# Altium schematic sheet Microcontroller.SchDoc: Micro
size 420 x 297 mm; Date: UNUSED; CompanyName: CMT; DrawnBy: UNUSED; Engineer: UNUSED; Organization: Curtin Motorsport Team; Address1: Rm 151 Building 206; Address2: Curtin University; Address3: Kent Street, Bentley; Address4: Western Australia; DocumentNumber: UNUSED; Revision: UNUSED; SheetNumber: 3; SheetTotal: 5; Year: UNUSED; SheetSize: A3; Time: UNUSED; ImagePath: UNUSED; Application_BuildNumber: UNUSED
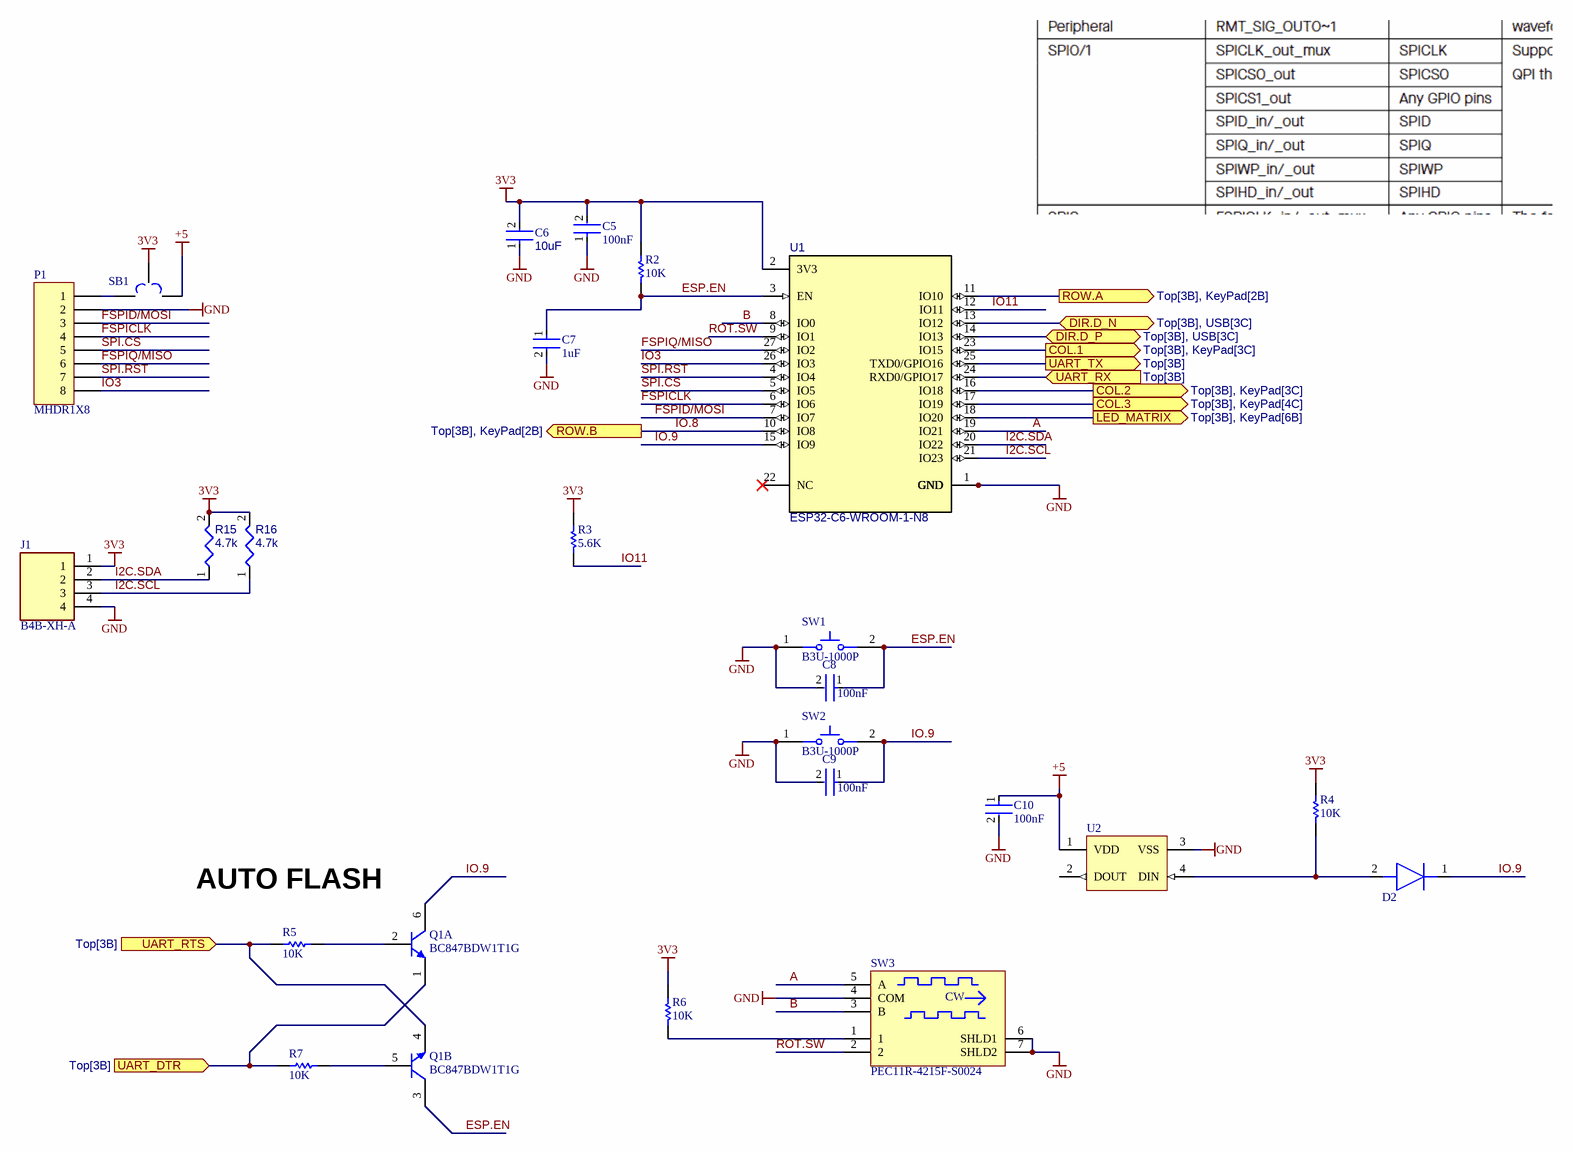
[diagram p0: Microcontroller.SchDoc]

## Parts
C5  100nF  [FP-GRM188-0_1-e0_2_0_55-IPC_A]
C6  Capacitance: 10uF  [FP-C1608-080-IPC_A]  (hidden comment: C1608X5R1E106M080AC)
C7  1uF  [FP-CC0603-DA-MFG]
C8  100nF  [FP-GRM188-0_1-e0_2_0_55-IPC_A]
C9  100nF  [FP-GRM188-0_1-e0_2_0_55-IPC_A]
C10  100nF  [FP-GRM188-0_1-e0_2_0_55-IPC_A]
D2  NSVR1020MW2T1G  [SOD2512X110N]  (value not drawn)
J1  B4B-XH-A  [B4BXHA]
P1  MHDR1X8  [MHDR1X8]
Q1  BC847BDW1T1G  [ONSC-SOT-363-6-419B-02_W_V]  (parts A,B of 2)
R2  10K  [RESC1609X50X30NL10T20]
R3  5.6K  [RESC1609X50X30NL10T20]
R4  10K  [RESC1609X50X30NL10T20]
R5  10K  [RESC1609X50X30NL10T20]
R6  10K  [RESC1609X50X30NL10T20]
R7  10K  [RESC1609X50X30NL10T20]
R15  value 4.7k  [RESC1608X55X25ML10T15]  (hidden comment: Resistor 4k7 +/-1% 0603 100 mW)
R16  value 4.7k  [RESC1608X55X25ML10T15]  (hidden comment: Resistor 4k7 +/-1% 0603 100 mW)
SB1  3 POS Solder Bridge  [3 POS Solder Bridge-Footprint-1]  (value not drawn)  (no BOM)
SW1  B3U-1000P  [OMRON-B3U-1000_V]
SW2  B3U-1000P  [OMRON-B3U-1000_V]
SW3  PEC11R-4215F-S0024  [BOUR-PEC11R-4XXXF-SXXXX_V]
U1  ESP32-C6-WROOM-1-N8  [ESP32-C6-WROOM-1-N8-Footprint-1]
U2  WS2812B  [ADAI-WS2812B_V]  (value not drawn)

## Ports
COL.1 (out, see Top[3B], KeyPad[3C]), COL.2 (out, see Top[3B], KeyPad[3C]), COL.3 (out, see Top[3B], KeyPad[4C]), DIR.D_N (bidir, see Top[3B], USB[3C]), DIR.D_P (bidir, see Top[3B], USB[3C]), LED_MATRIX (out, see Top[3B], KeyPad[6B]), ROW.A (out, see Top[3B], KeyPad[2B]), ROW.B (out, see Top[3B], KeyPad[2B]), UART_DTR (in, see Top[3B]), UART_RTS (in, see Top[3B]), UART_RX (in, see Top[3B]), UART_TX (out, see Top[3B])

## Nets
3V3: C5.2 C6.2 J1.1 R2.1 R3.1 R4.1 R6.1 R15.2 R16.2 SB1.2 U1.2(3V3)
+5: C10.1 SB1.3 U2.1(VDD)
GND: C5.1 C6.1 C7.2 C8.2 C9.2 C10.2 J1.4 P1.2 SW1.1 SW2.1 SW3.4(COM) SW3.6(SHLD1) SW3.7(SHLD2) U1.1(GND) U1.28(GND) U1.29_1(GND) U1.29_2(GND) U1.29_3(GND) U1.29_4(GND) U1.29_5(GND) U1.29_6(GND) U1.29_7(GND) U1.29_8(GND) U1.29_9(GND) U2.3(VSS)
A: SW3.5(A) U1.19(IO21)
B: SW3.3(B) U1.8(IO0)
COL.1: U1.23(IO15) ; port COL.1
COL.2: U1.16(IO18) ; port COL.2
COL.3: U1.17(IO19) ; port COL.3
DIR.D_N: U1.13(IO12) ; port DIR.D_N
DIR.D_P: U1.14(IO13) ; port DIR.D_P
ESP.EN: C7.1 C8.1 Q1.3(C) R2.2 SW1.2 U1.3(EN)
FSPICLK: P1.4 U1.6(IO6)
FSPID/MOSI: P1.3 U1.7(IO7)
FSPIQ/MISO: P1.6 U1.27(IO2)
I2C.SCL: J1.3 R16.1 U1.21(IO23)
I2C.SDA: J1.2 R15.1 U1.20(IO22)
IO3: P1.8 U1.26(IO3)
IO11: R3.2 U1.12(IO11)
IO.8: U1.10(IO8) ; port ROW.B
IO.9: C9.1 D2.1(K) Q1.6(C) SW2.2 U1.15(IO9)
LED_MATRIX: U1.18(IO20) ; port LED_MATRIX
ROT.SW: SW3.2 U1.9(IO1)
ROW.A: U1.11(IO10) ; port ROW.A
SPI.CS: P1.5 U1.5(IO5)
SPI.RST: P1.7 U1.4(IO4)
UART_DTR: Q1.1(E) R7.1 ; port UART_DTR
UART_RTS: Q1.4(E) R5.1 ; port UART_RTS
UART_RX: U1.24(RXD0/GPIO17) ; port UART_RX
UART_TX: U1.25(TXD0/GPIO16) ; port UART_TX
NetD2_2: D2.2(A) R4.2 U2.4(DIN)
NetP1_1: P1.1 SB1.1
NetQ1_2: Q1.2(B) R5.2
NetQ1_5: Q1.5(B) R7.2
NetR6_2: R6.2 SW3.1

Not connected (* = marked no-connect by the designer): U1 22(NC)*; U2 2(DOUT)

## Notes on the sheet
- (near R5) AUTO FLASH
- Project:
- Title:
- Project Number:
- Size:
- Status:
- Revision:
- Year:
- Design Date:
- Author:
- Latest Revision Date:
- Sheet
- Checked:
- Checked
- of
- Date:
- (in symbol CMP-011-00007-2) CW

## Library data of the parts
C5 C8-C10 = CMP-2006-02792-2: Chip Multilayer Ceramic Capacitors for General Purpose, 0603, 10uF, X5R, 15%, 20%, 6.3V; Packaging: Tape and Reel; Voltage Rating (DC): 6.3V; Width: 0.031inch; Termination: SMD/SMT; Dielectric: X5R; Package Quantity: 4000; Voltage Rating: 6.3V; Capacitance: 10uF; Case/Package: 0603; Min Operating Temperature: -55°C; Voltage: 6.3V; Length: 1.6mm; Thickness: 0.035inch; Lead Free: Lead Free; Depth: 0.8mm; Case Code (Imperial): 0603; Max Operating Temperature: 85°C; Material: Ceramic; Height: 0.8mm; Tolerance: 20%; Mount: Surface Mount; REACH SVHC: No SVHC; Radiation Hardening: No; Case Code (Metric): 1608
C6 = CMP-2000-05442-2: CAP CER 10UF 25V X5R 0603; Dielectric Material: Ceramic; Tolerance: 20%; Dielectric: X5R; Length: 1.6mm; Termination: SMD/SMT; Depth: 0.8mm; RoHS Compliant: Yes; Construction: Flat; Weight: 7.1E-05oz; Thickness: 0.039inch; Packaging: Tape and Reel; Min Operating Temperature: -55°C; Case Code (Imperial): 0603; Case/Package: 0603; Height: 0.8mm; Case Code (Metric): 1608; Voltage Rating: 25V; Resistor Type: Ceramic; Voltage Rating (DC): 25V; Max Operating Temperature: 85°C; REACH SVHC: No SVHC; Lead Free: Lead Free; Series: C; Width: 0.8mm; Mount: Surface Mount; Package Quantity: 1
C7 = CMP-03422-000924-1: CAP CER 1UF 16V X7R 0603; Manufacturer: YAGEO; Manufacturer Part Number: CC0603KRX7R7BB105; Tolerance: 0.1; Temperature Coefficient: 15%; Material: Ceramic; Package: CC0603-DA; RoHS: TRUE; Device Class L2: Capacitors; Temperature Characteristic: X7R; Temperature: -55°C to +125°C; Temperature Range Low: -55°C; Automotive: No; ComponentLink2Description: Datasheet; Value: 1 uF; Lead Free: Yes; Capacitance: 1 uF; ComponentLink2URL: http://www.yageo.com/documents/recent/UPY-GPHC_X7R_6.3V-to-50V_18.pdf; Device Class L1: Passive Components; Voltage: 16 V; Octopart: https://octopart.com/cc0603krx7r7bb105-yageo-42271928; Category: Cap; Digikey Description: CAP CER 1UF 16V X7R 0603; Footprint Url: http://www.yageo.com/exep/pages/download/literatures/UPY-C_GEN_24.pdf; Height: 0.9mm; Voltage Rating: 16 V; Temperature Range High: +125°C; Mouser Description: Multilayer Ceramic Capacitor, CC Series, 1 - F, - 10%, X7R, 16 V, 0603 [1608 Metric]; Device Class L3: Ceramic Capacitors
D2 = CMP-020-000003-1: Diode; Manufacturer_Name: onsemi; Design Item ID: NSVR1020MW2T1G; Datasheet Link: http://www.onsemi.com/pub/Collateral/NSR1020MW2T1-D.PDF; Arrow Price/Stock: https://www.arrow.com/en/products/nsvr1020mw2t1g/on-semiconductor; Height: 1.1mm; Mouser Part Number: 863-NSVR1020MW2T1G; Mouser Price/Stock: https://www.mouser.co.uk/ProductDetail/onsemi/NSVR1020MW2T1G?qs=tCMd4XlZ%2FiDUu7qH%252Bxas4w%3D%3D; Manufacturer_Part_Number: NSVR1020MW2T1G; Source: SamacSys.SchLib; Arrow Part Number: NSVR1020MW2T1G
J1 = CMP-019-000017-1: Connector; Manufacturer_Name: JST (JAPAN SOLDERLESS TERMINALS); Height: 7mm; Datasheet Link: https://www.jst-mfg.com/product/pdf/eng/eXH.pdf; Design Item ID: B4B-XH-A; Manufacturer_Part_Number: B4B-XH-A; Source: SamacSys.SchLib
P1 = CMP-011-000321-1: Header, 8-Pin; Signal Integrity: Connector; LatestRevisionDate: 17-Jul-2002; Publisher: Altium Limited; LatestRevisionNote: Re-released for DXP Platform.; Source: Miscellaneous Connectors.SchLib; Component Type: Standard; Pin Count: 8; Design Item ID: MHDR1X8
Q1 = CMP-1048-00875-1: Dual General Purpose Transistors, NPN, 6-Pin SOT-363, Pb-Free, Tape and Reel; Manufacturer: On Semiconductor; fT Min (MHz): 100; IC Continuous (A): 0.1; Polarity: Dual NPN; ComponentLink3Description: Package Specification; PackageReference: SOT-363-6-419B-02_W; RoHS: TRUE; PackageVersion: Rev. W, 01/2006; Packing: Tape and Reel; Mounting Technology: Surface Mount; ComponentLink3URL: http://www.onsemi.com/pub_link/Collateral/NTJD4001N-D.PDF; ComponentLink2URL: http://www.onsemi.cn/pub_link/Collateral/BC846BDW1T1-D.PDF; ComponentLink2Description: Datasheet; ComponentLink1Description: Manufacturer URL; PartNumber: BC847BDW1T1G; DatasheetVersion: Rev. 9; PackageDescription: 6-Pin Small Outline Transistor, Body 2 x 1.25 mm, Pitch 0.65 mm; ComponentLink1URL: http://www.onsemi.com/
R2-R7 = CMP-1012-00708-2: Part Number: CRCW060356K0FKEA; Manufacturer: Vishay Dale
R15 R16 = CMP-009-00031-7: Chip Resistor, 4.7 KOhm, +/- 1%, 0.1 W, -55 to 155 degC, 0603 (1608 Metric); Manufacturer_Part_Number: RC0603FR-134K7L; Manufacturer_Name: Yageo; Power: 100mW; Min Operating Temperature: -55°C; Case/Package: 0603; RoHS Compliant: True; Tolerance: 1%; Max Operating Temperature: 155°C; Pins: 2; Mounting Technology: SM
SB1 = CMP-016-000000-3: 3 position solder bridge; Source: StrainComponents.SchLib; Design Item ID: 3 POS SB
SW1 SW2 = CMP-011-00000-2: Tactile Switch, SPST-NO, 0.05 A, 12 V, -25 to 70 degC, 2-Pin SMD, RoHS, Tape and Reel; Manufacturer: Omron Electronic Components; IP Rating: IP40; Current Rating: 50mA; Max Contact Resistance: 100mohm; Operating Force: 153gf; Throw Configuration: SPST; Resistance: 0.1Ohm; Max Voltage Rating (DC): 12V; Contact Material: Silver; Max Current Rating: 50mA; Datasheet URL: http://www.omron.com/ecb/products/pdf/en-b3u.pdf; Mounting Technology: SM; Case/Package: B3U-1000; Packaging: TapeandReel; Package Reference: B3U-1000; Manufacturer URL: http://www.omron.com/; Datasheet Version: Jan-15; RoHS Compliant: True; Max Operating Temperature: 70°C; Contact Current Rating: 50mA; Package Quantity: 3500; Package Description: 2-Pin Surface Mount Device, Body 3 x 2.5 mm; Voltage Rating (DC): 12V; Min Operating Temperature: -25°C; Voltage Rating: 12V
SW3 = CMP-011-00007-2: 12 mm Incremental Encoder, 24 Detent, -30 to 70 degC, 5-Pin THD, RoHS, Bulk; Manufacturer: Bourns; Channels: 2; RoHS Compliant: True; Product Type: Mechanical; Datasheet Version: Jul-14; Package Quantity: 150; Manufacturer URL: http://www.bourns.com/; Case/Package: PEC11R-4XXXF-SXXXX; Packaging: Bulk; Package Reference: PEC11R-4XXXF-SXXXX; Min Operating Temperature: -30°C; Max Operating Temperature: 70°C; Datasheet URL: http://www.bourns.com/docs/Product-Datasheets/PEC11R.pdf; Mounting Technology: TH; Package Description: 5-Pin Through Hole Device, Body 12.5 x 13.4 mm
U1 = CMP-021-00007-3: ESP32-C6-WROOM-1-N8 Engineering Module - 8 MB Quad SPI Flash; Nominal Supply Voltage: 3.3V; Frequency: 128MHz; Flash: 8 MB; Mounting Technology: SMT; Case/Package: 28-SMD Module; Pins: 28
U2 = CMP-007-00035-2: Intelligent Control LED Integrated Light Source, 3.5 to 5.3 V, -25 to 80 degC, 4-Pin SMD, RoHS, Bulk; Manufacturer: Adafruit Industries; Datasheet URL: https://cdn-shop.adafruit.com/datasheets/WS2812B.pdf; Manufacturer URL: https://www.adafruit.com/; Datasheet Version: May-13; Case/Package: WS2812B; Mounting Technology: SM; RoHS Compliant: False; Package Description: 4-Pin Surface Mount Device, Body 5 x 5 mm, Pitch 3.3 mm; Package Reference: WS2812B